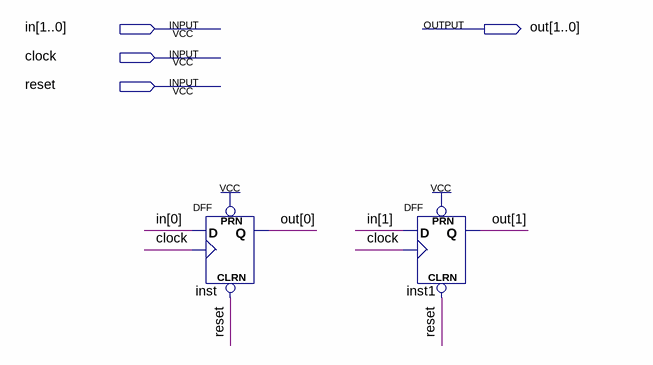
[diagram p0: schematic sheet]
// Quartus schematic Register_2b.bdf as structural Verilog: 2 symbols, 4 pins
module Register_2b (
  input  [1:0] in,
  input  clock,
  input  reset,
  output [1:0] out
);

  DFF inst (.CLRN(reset), .CLK(clock), .D(in[0]), .PRN(1'b1), .Q(out[0]));
  DFF inst1 (.CLRN(reset), .CLK(clock), .D(in[1]), .PRN(1'b1), .Q(out[1]));
endmodule
